# Altium schematic sheet MICROPHONE.SchDoc
size A
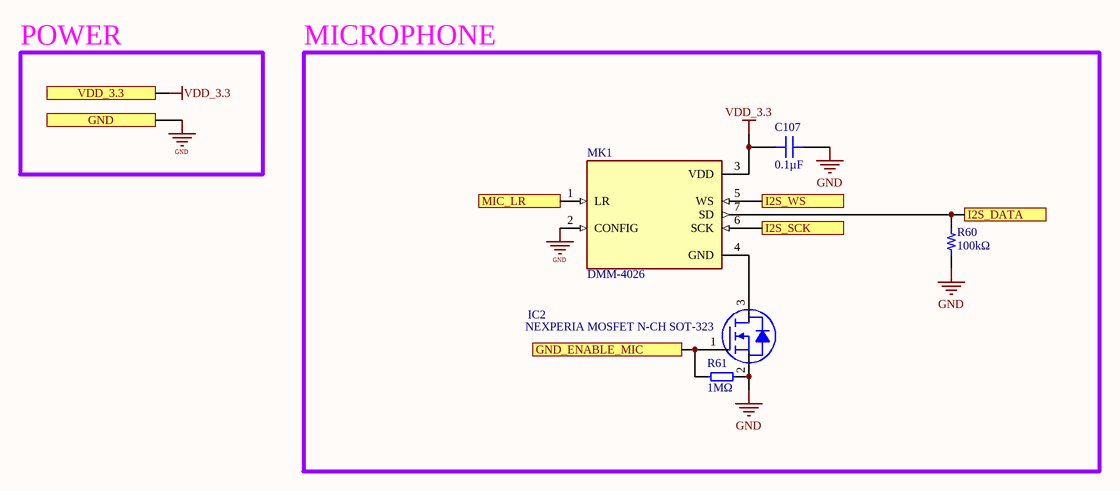
[diagram p0: MICROPHONE.SchDoc]

## Parts
C107  0.1µF  [CAP 0603_1608 RF]
IC2  NEXPERIA MOSFET N-CH SOT-323  [NEXPERIA SOT-323]
MK1  DMM-4026  [DMM-4026]
R60  100kΩ  [RES 0603_1608 RF]
R61  1MΩ  [0603_1608 RF]  (no BOM)

## Blocks framed on the sheet
MICROPHONE: C107 IC2 MK1 R60 R61

## Ports
GND, GND_ENABLE_MIC, I2S_DATA, I2S_SCK, I2S_WS, MIC_LR, VDD_3.3

## Nets
GND: C107.2 IC2.2(S) MK1.2(CONFIG) R60.1 R61.1 ; port GND
VDD_3.3: C107.1 MK1.3(VDD) ; port VDD_3.3
GND_ENABLE_MIC: IC2.1(G) R61.2 ; port GND_ENABLE_MIC
I2S_DATA: MK1.7(SD) R60.2 ; port I2S_DATA
I2S_SCK: MK1.6(SCK) ; port I2S_SCK
I2S_WS: MK1.5(WS) ; port I2S_WS
MIC_LR: MK1.1(LR) ; port MIC_LR
NetIC2_3: IC2.3(D) MK1.4(GND)

## Notes on the sheet
- POWER

## Library data of the parts
C107 = CAP00039: CAP CER 0.1UF 16V X7R 0603; Manufacturer: KEMET; Manufacturer P/N: C0603C104M4RACAUTO; Tolerance: ±20%; Device ID: CAP00039; Mounting Type: Surface Mount; Part Type: Capacitor; VALUE: 0.1µF; Operating Temperature: -55°C ~ 125°C; Voltage: 16V; Package: 0603 (1608 Metric); Supplier1: Digi-Key; Supplier1 P/N: 399-C0603C104M4RACAUTOCT-ND; Supplier2: Mouser; Supplier2 P/N: C0603C104M4RACAUTO; Temperature Coefficient: X7R
IC2 = MOS00000: MOSFET N-CH 60V 320MA SOT323; Manufacturer: Nexperia USA Inc.; Manufacturer P/N: BSS138PW,115; FET Type: N-Channel; VALUE: NFET; Current - Continuous Drain (Id) @ 25°C: 320mA (Ta); Drive Voltage (Max Rds On, Min Rds On): 10V; Rds On (Max) @ Id, Vgs: 1.6Ohm @ 300mA, 10V; Vgs(th) (Max) @ Id: 1.5V @ 250µA; Vgs (Max): ±20V; Power Dissipation (Max): 260mW (Ta), 830mW (Tc); Gate Charge (Qg) (Max) @ Vgs: 0.8 nC @ 4.5 V; Input Capacitance (Ciss) (Max) @ Vds: 50 pF @ 10 V; Device ID: MOS00000; Package: SOT-323; Part Type: IC; Technology: MOSFET (Metal Oxide); FET Feature: -; Operating Temperature: -55°C ~ 150°C (TA); Mounting Type: Surface Mount; Drain to Source Voltage (Vdss): 60V; Supplier1: Digi-Key; Supplier1 P/N: 1727-1143-1-ND; Supplier2: Mouser; Supplier2 P/N: 771-BSS138PW115
MK1 = MIC00001: DIFFERENTIAL ANALOG OUTPUT MEMS; Manufacturer: TDK InvenSense; Manufacturer P/N: ICS-40638; MP: DMM-4026-B-I2S-R; Value: MEMS Microphone; MF: PUI Audio, Inc.; Current - Supply: 170µA; Voltage Supply: 1.52V ~ 3.63V; Bandwidth: 35Hz ~ 20.0kHz; Direction: Omnidirectional; Sensitivity: -43dB ±1dB @ 94dB SPL; Impedance: 355Ω; S/N Ratio: 63dB; Check_prices: https://www.snapeda.com/parts/DMM-4026-B-I2S-R/PUI+Audio%252C+Inc./view-part/?ref=eda; Purchase-URL: https://pricing.snapeda.com/search/part/DMM-4026-B-I2S-R/?ref=eda; SnapEDA_Link: https://www.snapeda.com/parts/DMM-4026-B-I2S-R/PUI+Audio%252C+Inc./view-part/?ref=snap; Digi-Key_Part_Number: 668-DMM-4026-B-I2S-RCT-ND; Package: 5-Pad Custom SMD; Device ID: MIC00001; Part Type: IC; Operating Temperature: -40°C ~ 105°C; Supplier1: Digi-Key; Output Type: Differential Analog; Supplier1 P/N: 1428-ICS-40638CT-ND; Supplier2: Mouser; Supplier2 P/N: 410-ICS-40638; Mounting Type: Surface Mount
R60 = RES00025: RES 100k OHM 1% 1/10W 0603; Manufacturer: Vishay Dale; Manufacturer P/N: ‎CRCW0603820KFKEAC‎; Power: 0.100W; Device ID: RES00025; VALUE: 100kΩ; Mounting Type: Surface Mount; Part Type: Resistor; Operating Temperature: -55°C ~ 155°C; Package: 0603 (1608 Metric); Tolerance: ±1%; Composition: Thick Film; Supplier1: Digi-Key; Supplier1 P/N: ‎541-5568-1-ND‎; Supplier2: Mouser; Supplier2 P/N: 71-CRCW0603820KFKEAC
R61 = RFP00002: 0603 RF Passive; VALUE: 0603; Device ID: RFP00002; Mounting Type: Surface Mount; Part Type: Passive